# EAGLE design OpenMV-2L (EAGLE 7.5.0)
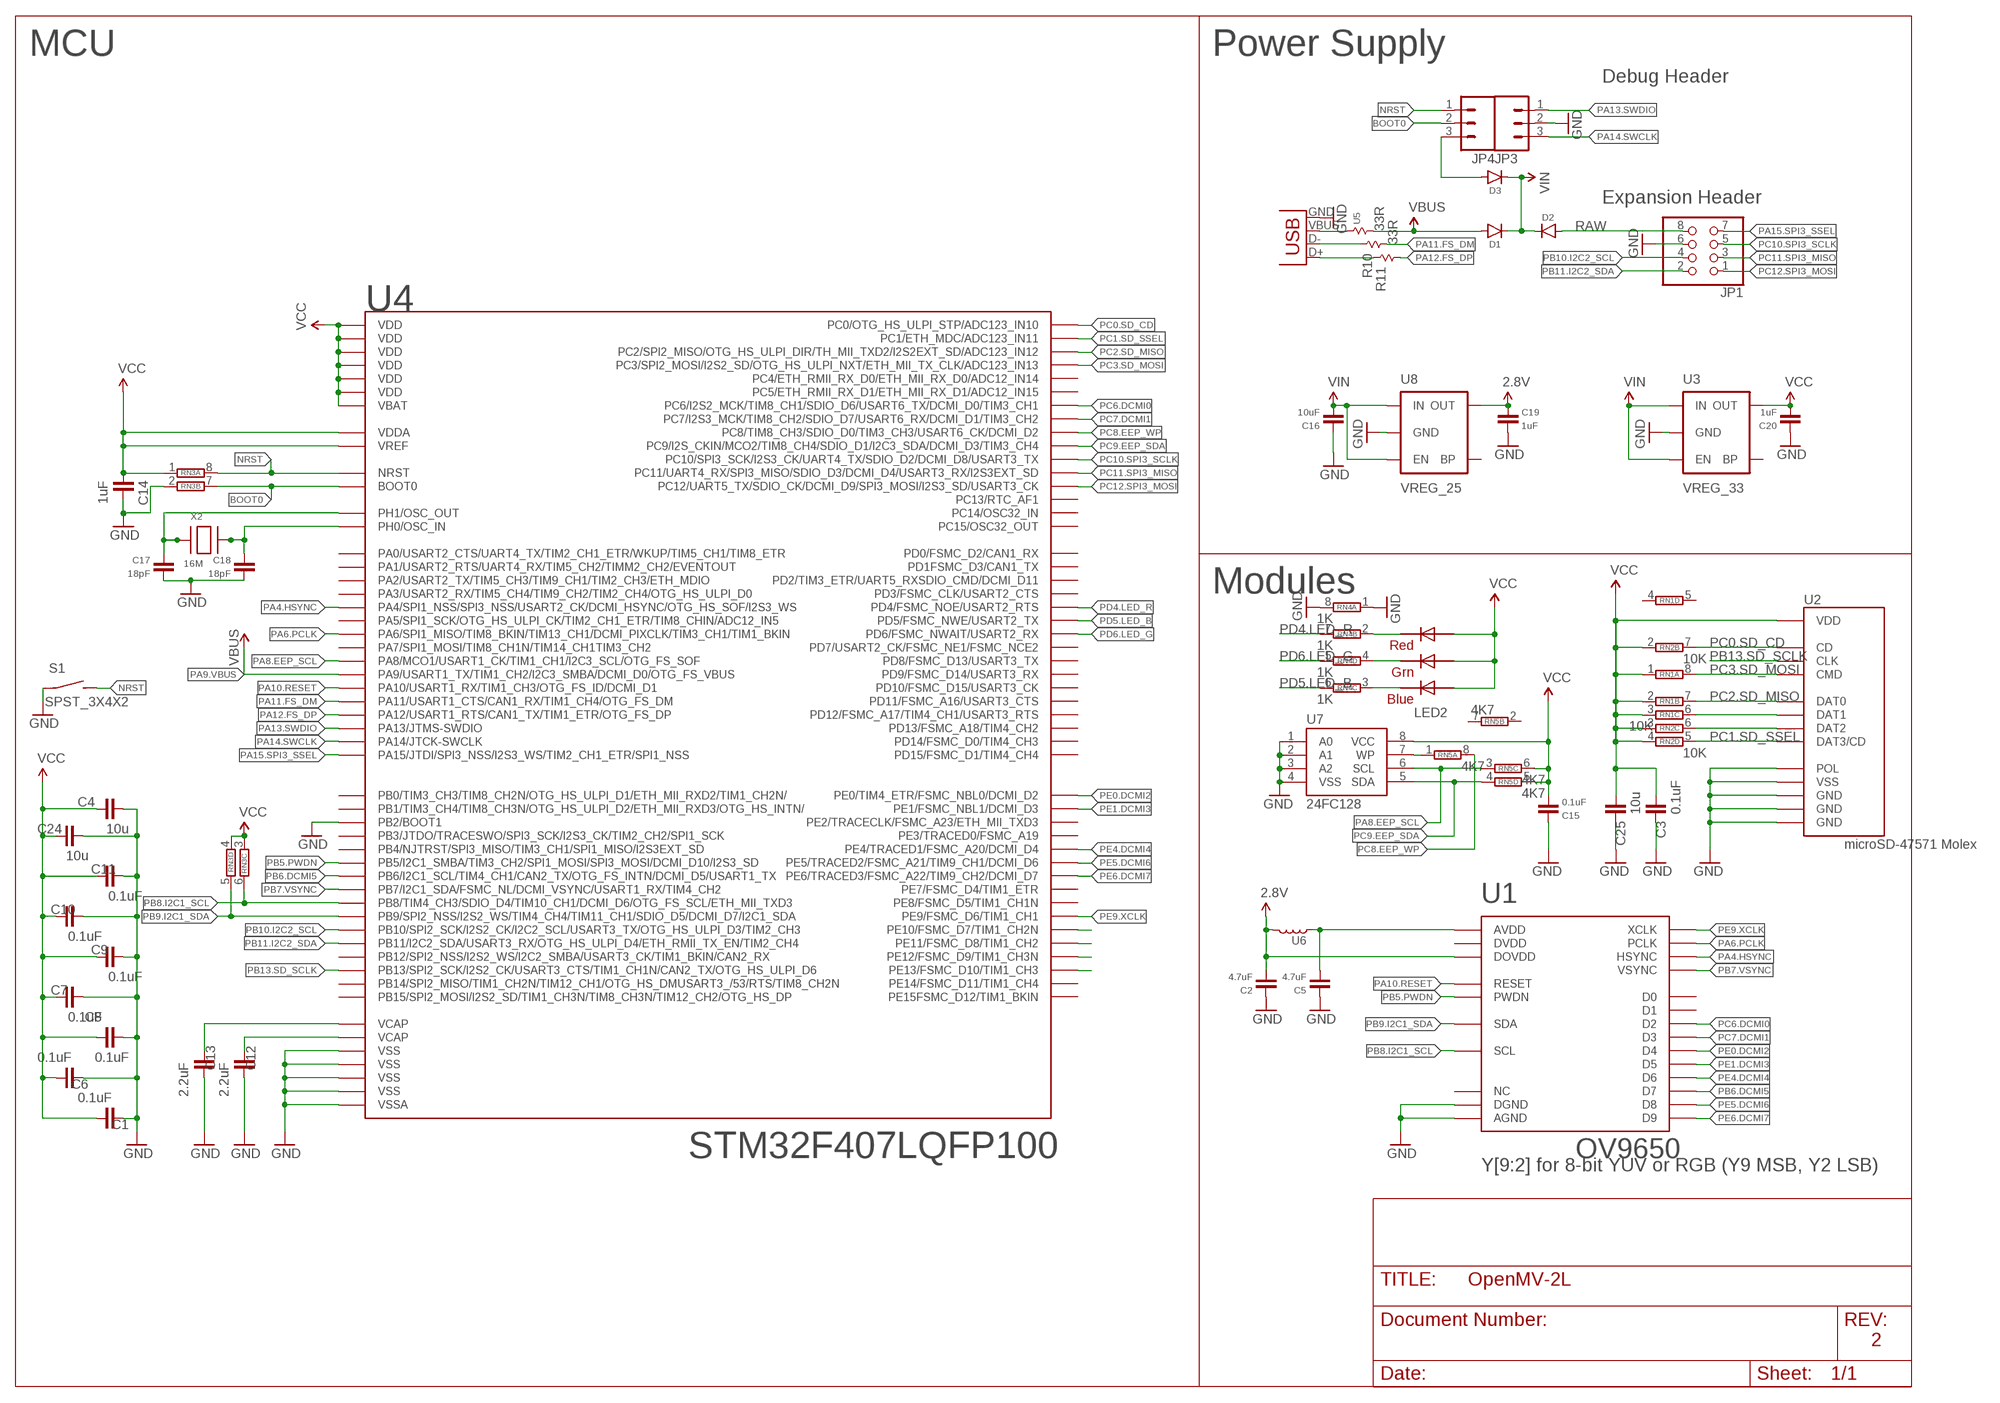
[diagram p0: schematic, sheet 1]

## Parts
C1  0.1uF  CAP-0402  [0402]
C2  4.7uF  CAP-0603  [0603]
C3  0.1uF  CAP-0402  [0402]
C4  10u  CAP-0805  [0805]
C5  4.7uF  CAP-0603  [0603]
C6  0.1uF  CAP-0402  [0402]
C7  0.1uF  CAP-0402  [0402]
C8  0.1uF  CAP-0402  [0402]
C9  0.1uF  CAP-0402  [0402]
C10  0.1uF  CAP-0402  [0402]
C11  0.1uF  CAP-0402  [0402]
C12  2.2uF  CAP-0402  [0402]
C13  2.2uF  CAP-0402  [0402]
C14  1uF  CAP-0402  [0402]
C15  0.1uF  CAP-0603  [0603]
C16  10uF  CAP-0805  [0805]
C17  18pF  CAP-0402  [0402]
C18  18pF  CAP-0402  [0402]
C19  1uF  CAP-0603  [0603]
C20  1uF  CAP-0603  [0603]
C24  10u  CAP-0805  [0805]
C25  10u  CAP-0805  [0805]
D1  DIODE-SOD-323  [SOD-323]
D2  DIODE-SOD-323  [SOD-323]
D3  DIODE-SOD-323  [SOD-323]
JP1  PINHD-2X4  [2X04]
JP3  M03PTH  [1X03]
JP4  M03PTH  [1X03]
LED2  RGBLED5050  [RGBLED5050]
R10  33R  RESISTOR-0402  [0402]
R11  33R  RESISTOR-0402  [0402]
RN1  4R-NCAT16  [CAT16]
RN2  10K  4R-NCAT16  [CAT16]
RN3  4R-NCAT16  [CAT16]
RN4  1K  4R-NCAT16  [CAT16]
RN5  4K7  4R-NCAT16  [CAT16]
S1  SPST_3X4X2  [3X4X2TACT]
U1  OV9650  [OV9650]
U2  microSD-47571 Molex  USD-47571  [USD-47571]
U3  VREG_33  V_REG_LDOSMD  [SOT23-5]
U4  STM32F407LQFP100  [LQFP100]
U5  RESISTOR-0402  [0402]
U6  INDUCTOR-0603  [0603]
U7  24FC128  [MSOP8]
U8  VREG_25  V_REG_LDOSMD  [SOT23-5]
X1  USB-MICROB  [USB-MICROB]
X2  16M  XTALNX5032  [NX5032]

## Nets
2.8V: C2.1 C19.2 U1.P$11(DOVDD) U6.2 U8.5(OUT)
BOOT0: JP4.2 RN3.7 U4.94(BOOT0)
GND: C1.1 C2.2 C3.2 C4.1 C5.2 C6.1 C7.2 C8.1 C9.2 C10.2 C11.2 C12.2 C13.2 C14.1 C15.2 C16.2 C17.1 C18.1 C19.1 C20.2 C24.1 C25.2 JP1.6 JP3.2 RN3.2 RN4.1 RN4.8 S1.P$1(P) U1.P$2(AGND) U1.P$15(DGND) U2.G$1(GND) U2.G$2(GND) U2.G$3(GND) U2.G$4(POL) U2.P$6(VSS) U3.2(GND) U4.10(VSS) U4.20(VSSA) U4.27(VSS) U4.37(PB2/BOOT1) U4.74(VSS) U4.99(VSS) U7.1(A0) U7.2(A1) U7.3(A2) U7.4(VSS) U8.2(GND) X1.GND
N$1: RN1.6 U2.P$8(DAT1)
N$2: RN2.6 U2.P$1(DAT2)
N$3: LED2.5(RED_C) RN4.2
N$4: LED2.6(GREEN_C) RN4.4
N$5: LED2.4(BLUE_C) RN4.3
N$6: C17.2 U4.13(PH1/OSC_OUT) X2.P$1
N$8: C18.2 U4.12(PH0/OSC_IN) X2.P$2
N$9: RN5.1 U7.7(WP)
N$10: C5.1 U1.P$4(AVDD) U6.1
N$11: D3.2(A) JP4.3
N$12: U4.41(PE10/FSMC_D7/TIM1_CH2N)
N$13: U4.42(PE11/FSMC_D8/TIM1_CH2)
N$14: U4.43(PE12/FSMC_D9/TIM1_CH3N)
N$15: U4.44(PE13/FSMC_D10/TIM1_CH3)
N$20: R10.1 X1.D-
N$21: R11.1 X1.D+
N$22: U5.1 X1.VBUS
NRST: JP4.1 RN3.8 S1.P$2(S) U4.14(NRST)
PA4.HSYNC: U1.P$9(HSYNC) U4.29(PA4/SPI1_NSS/SPI3_NSS/USART2_CK/DCMI_HSYNC/OTG_HS_SOF/I2S3_WS)
PA6.PCLK: U1.P$17(PCLK) U4.31(PA6/SPI1_MISO/TIM8_BKIN/TIM13_CH1/DCMI_PIXCLK/TIM3_CH1/TIM1_BKIN)
PA8.EEP_SCL: RN5.3 U4.67(PA8/MCO1/USART1_CK/TIM1_CH1/I2C3_SCL/OTG_FS_SOF) U7.6(SCL)
PA9.VBUS: D1.2(A) U4.68(PA9/USART1_TX/TIM1_CH2/I2C3_SMBA/DCMI_D0/OTG_FS_VBUS) U5.2 ; supply symbol labelled VBUS
PA10.RESET: U1.P$6(RESET) U4.69(PA10/USART1_RX/TIM1_CH3/OTG_FS_ID/DCMI_D1)
PA11.FS_DM: R10.2 U4.70(PA11/USART1_CTS/CAN1_RX/TIM1_CH4/OTG_FS_DM)
PA12.FS_DP: R11.2 U4.71(PA12/USART1_RTS/CAN1_TX/TIM1_ETR/OTG_FS_DP)
PA13.SWDIO: JP3.1 U4.72(PA13/JTMS-SWDIO)
PA14.SWCLK: JP3.3 U4.76(PA14/JTCK-SWCLK)
PA15.SPI3_SSEL: JP1.7 U4.77(PA15/JTDI/SPI3_NSS/I2S3_WS/TIM2_CH1_ETR/SPI1_NSS)
PB5.PWDN: U1.P$8(PWDN) U4.91(PB5/I2C1_SMBA/TIM3_CH2/SPI1_MOSI/SPI3_MOSI/DCMI_D10/I2S3_SD)
PB6.DCMI5: U1.P$16(D7) U4.92(PB6/I2C1_SCL/TIM4_CH1/CAN2_TX/OTG_FS_INTN/DCMI_D5/USART1_TX)
PB7.VSYNC: U1.P$7(VSYNC) U4.93(PB7/I2C1_SDA/FSMC_NL/DCMI_VSYNC/USART1_RX/TIM4_CH2)
PB8.I2C1_SCL: RN3.6 U1.P$5(SCL) U4.95(PB8/TIM4_CH3/SDIO_D4/TIM10_CH1/DCMI_D6/OTG_FS_SCL/ETH_MII_TXD3)
PB9.I2C1_SDA: RN3.5 U1.P$3(SDA) U4.96(PB9/SPI2_NSS/I2S2_WS/TIM4_CH4/TIM11_CH1/SDIO_D5/DCMI_D7/I2C1_SDA)
PB10.I2C2_SCL: JP1.4 U4.47(PB10/SPI2_SCK/I2S2_CK/I2C2_SCL/USART3_TX/OTG_HS_ULPI_D3/TIM2_CH3)
PB11.I2C2_SDA: JP1.2 U4.48(PB11/I2C2_SDA/USART3_RX/OTG_HS_ULPI_D4/ETH_RMII_TX_EN/TIM2_CH4)
PB13.SD_SCLK: U2.P$5(CLK) U4.52(PB13/SPI2_SCK/I2S2_CK/USART3_CTS/TIM1_CH1N/CAN2_TX/OTG_HS_ULPI_D6)
PC0.SD_CD: RN2.7 U2.G$5(CD) U4.15(PC0/OTG_HS_ULPI_STP/ADC123_IN10)
PC1.SD_SSEL: RN2.5 U2.P$2(DAT3/CD) U4.16(PC1/ETH_MDC/ADC123_IN11)
PC2.SD_MISO: RN1.7 U2.P$7(DAT0) U4.17(PC2/SPI2_MISO/OTG_HS_ULPI_DIR/TH_MII_TXD2/I2S2EXT_SD/ADC123_IN12)
PC3.SD_MOSI: RN1.8 U2.P$3(CMD) U4.18(PC3/SPI2_MOSI/I2S2_SD/OTG_HS_ULPI_NXT/ETH_MII_TX_CLK/ADC123_IN13)
PC6.DCMI0: U1.P$19(D2) U4.63(PC6/I2S2_MCK/TIM8_CH1/SDIO_D6/USART6_TX/DCMI_D0/TIM3_CH1)
PC7.DCMI1: U1.P$21(D3) U4.64(PC7/I2S3_MCK/TIM8_CH2/SDIO_D7/USART6_RX/DCMI_D1/TIM3_CH2)
PC8.EEP_WP: RN5.8 U4.65(PC8/TIM8_CH3/SDIO_D0/TIM3_CH3/USART6_CK/DCMI_D2)
PC9.EEP_SDA: RN5.4 U4.66(PC9/I2S_CKIN/MCO2/TIM8_CH4/SDIO_D1/I2C3_SDA/DCMI_D3/TIM3_CH4) U7.5(SDA)
PC10.SPI3_SCLK: JP1.5 U4.78(PC10/SPI3_SCK/I2S3_CK/UART4_TX/SDIO_D2/DCMI_D8/USART3_TX)
PC11.SPI3_MISO: JP1.3 U4.79(PC11/UART4_RX/SPI3_MISO/SDIO_D3/DCMI_D4/USART3_RX/I2S3EXT_SD)
PC12.SPI3_MOSI: JP1.1 U4.80(PC12/UART5_TX/SDIO_CK/DCMI_D9/SPI3_MOSI/I2S3_SD/USART3_CK)
PD4.LED_R: RN4.7 U4.85(PD4/FSMC_NOE/USART2_RTS)
PD5.LED_B: RN4.6 U4.86(PD5/FSMC_NWE/USART2_TX)
PD6.LED_G: RN4.5 U4.87(PD6/FSMC_NWAIT/USART2_RX)
PE0.DCMI2: U1.P$22(D4) U4.97(PE0/TIM4_ETR/FSMC_NBL0/DCMI_D2)
PE1.DCMI3: U1.P$20(D5) U4.98(PE1/FSMC_NBL1/DCMI_D3)
PE4.DCMI4: U1.P$18(D6) U4.3(PE4/TRACED1/FSMC_A20/DCMI_D4)
PE5.DCMI6: U1.P$14(D8) U4.4(PE5/TRACED2/FSMC_A21/TIM9_CH1/DCMI_D6)
PE6.DCMI7: U1.P$12(D9) U4.5(PE6/TRACED3/FSMC_A22/TIM9_CH2/DCMI_D7)
PE9.XCLK: U1.P$13(XCLK) U4.40(PE9/FSMC_D6/TIM1_CH1)
RAW: D2.2(A) JP1.8
VCAP1: C13.1 U4.49(VCAP)
VCAP2: C12.1 U4.73(VCAP)
VCC: C1.2 C3.1 C4.2 C6.2 C7.1 C8.2 C9.1 C10.1 C11.1 C14.2 C15.1 C20.1 C24.2 C25.1 LED2.1(GREEN_A) LED2.2(RED_A) LED2.3(BLUE_A) RN1.1 RN1.2 RN1.3 RN2.2 RN2.3 RN2.4 RN3.1 RN3.3 RN3.4 RN5.5 RN5.6 U2.P$4(VDD) U3.5(OUT) U4.6(VBAT) U4.11(VDD) U4.19(VDD) U4.21(VREF) U4.22(VDDA) U4.28(VDD) U4.50(VDD) U4.75(VDD) U4.100(VDD) U7.8(VCC)
VIN: C16.1 D1.1(C) D2.1(C) D3.1(C) U3.1(IN) U3.3(EN) U8.1(IN) U8.3(EN)
Unconnected: RN1.4 RN1.5 RN2.1 RN2.8 RN5.2 RN5.7 U1.P$1(NC) U1.P$10(DVDD) U1.P$23(D1) U1.P$24(D0) U3.4(BP) U4.1(PE2/TRACECLK/FSMC_A23/ETH_MII_TXD3) U4.2(PE3/TRACED0/FSMC_A19) U4.7(PC13/RTC_AF1) U4.8(PC14/OSC32_IN) U4.9(PC15/OSC32_OUT) U4.23(PA0/USART2_CTS/UART4_TX/TIM2_CH1_ETR/WKUP/TIM5_CH1/TIM8_ETR) U4.24(PA1/USART2_RTS/UART4_RX/TIM5_CH2/TIMM2_CH2/EVENTOUT) U4.25(PA2/USART2_TX/TIM5_CH3/TIM9_CH1/TIM2_CH3/ETH_MDIO) U4.26(PA3/USART2_RX/TIM5_CH4/TIM9_CH2/TIM2_CH4/OTG_HS_ULPI_D0) U4.30(PA5/SPI1_SCK/OTG_HS_ULPI_CK/TIM2_CH1_ETR/TIM8_CHIN/ADC12_IN5) U4.32(PA7/SPI1_MOSI/TIM8_CH1N/TIM14_CH1TIM3_CH2) U4.33(PC4/ETH_RMII_RX_D0/ETH_MII_RX_D0/ADC12_IN14) U4.34(PC5/ETH_RMII_RX_D1/ETH_MII_RX_D1/ADC12_IN15) U4.35(PB0/TIM3_CH3/TIM8_CH2N/OTG_HS_ULPI_D1/ETH_MII_RXD2/TIM1_CH2N/) U4.36(PB1/TIM3_CH4/TIM8_CH3N/OTG_HS_ULPI_D2/ETH_MII_RXD3/OTG_HS_INTN/) U4.38(PE7/FSMC_D4/TIM1_ETR) U4.39(PE8/FSMC_D5/TIM1_CH1N) U4.45(PE14/FSMC_D11/TIM1_CH4) U4.46(PE15FSMC_D12/TIM1_BKIN) U4.51(PB12/SPI2_NSS/I2S2_WS/I2C2_SMBA/USART3_CK/TIM1_BKIN/CAN2_RX) U4.53(PB14/SPI2_MISO/TIM1_CH2N/TIM12_CH1/OTG_HS_DMUSART3_/53/RTS/TIM8_CH2N) U4.54(PB15/SPI2_MOSI/I2S2_SD/TIM1_CH3N/TIM8_CH3N/TIM12_CH2/OTG_HS_DP) U4.55(PD8/FSMC_D13/USART3_TX) U4.56(PD9/FSMC_D14/USART3_RX) U4.57(PD10/FSMC_D15/USART3_CK) U4.58(PD11/FSMC_A16/USART3_CTS) U4.59(PD12/FSMC_A17/TIM4_CH1/USART3_RTS) U4.60(PD13/FSMC_A18/TIM4_CH2) U4.61(PD14/FSMC_D0/TIM4_CH3) U4.62(PD15/FSMC_D1/TIM4_CH4) U4.81(PD0/FSMC_D2/CAN1_RX) U4.82(PD1FSMC_D3/CAN1_TX) U4.83(PD2/TIM3_ETR/UART5_RXSDIO_CMD/DCMI_D11) U4.84(PD3/FSMC_CLK/USART2_CTS) U4.88(PD7/USART2_CK/FSMC_NE1/FSMC_NCE2) U4.89(PB3/JTDO/TRACESWO/SPI3_SCK/I2S3_CK/TIM2_CH2/SPI1_SCK) U4.90(PB4/NJTRST/SPI3_MISO/TIM3_CH1/SPI1_MISO/I2S3EXT_SD) U8.4(BP)

## Notes on the sheet
- MCU | Power Supply
- Debug Header
- Expansion Header
- Modules
- Y[9:2] for 8-bit YUV or RGB (Y9 MSB, Y2 LSB)
- 2

## Library data of the parts
C1-C20 C24 C25 = X893:CAP: Capacitor
D1-D3 = X893:DIODE
JP1 = pinhead:PINHD-2X4: PIN HEADER
JP3 JP4 = SparkFun:M03: Header 3 Standard 3-pin 0.1" header. Use with straight break away headers (SKU : PRT-00116), right angle break away headers (PRT-00553), swiss pins (PRT-00743), machine pins (PRT-00117), and female headers (PRT-00115). Molex polarized connector foot print use with SKU : PRT-08232 with associated crimp pins and housings.
LED2 = adafruit:RGBLED: For 5050 RGB LEDs, the order of the LEDs may vary from one manufacturer to another!
R10 R11 U5 = X893:RESISTOR
RN1-RN5 = resistor-dil:4R-N: Array Chip Resistor Source: RS Component / Phycomp; OC_FARNELL: unknown; OC_NEWARK: unknown
S1 = bt_electromech:SPST: SPST SWITCH
U1 = iofault:OV9650
U2 = mux:USD-47571
U3 U8 = sfe:V_REG_LDO: Voltage Regulator LDO Standard 150mA LDO voltage regulator in SOT-23 layout. Micrel part MIC5205. BP (by-pass) pin is used to lower output noise with 470pF cap.
U4 = mux:STM32F407
U6 = X893:INDUCTOR: http://www.murata.com/products/catalog/pdf/o05e.pdf
U7 = mux:24FC128
X1 = sfe:USB: USB Connectors USB-B-PTH is fully proven SKU : PRT-00139 USB-miniB is fully proven SKU : PRT-00587 USB-A-PCB is untested. USB-A-H is throughly reviewed, but untested. Spark Fun Electronics SKU : PRT-00437 USB-B-SMT is throughly reviewed, but untested. Needs silkscreen touching up. USB-A-S has not been used/tested USB-MB-H has not been used/tested
X2 = adafruit:XTAL: Low cost SMT crystals, no capacitors included http://www.ladyada.net/library/eagle

## Net classes
0 default: width 0.152 mm

## Board
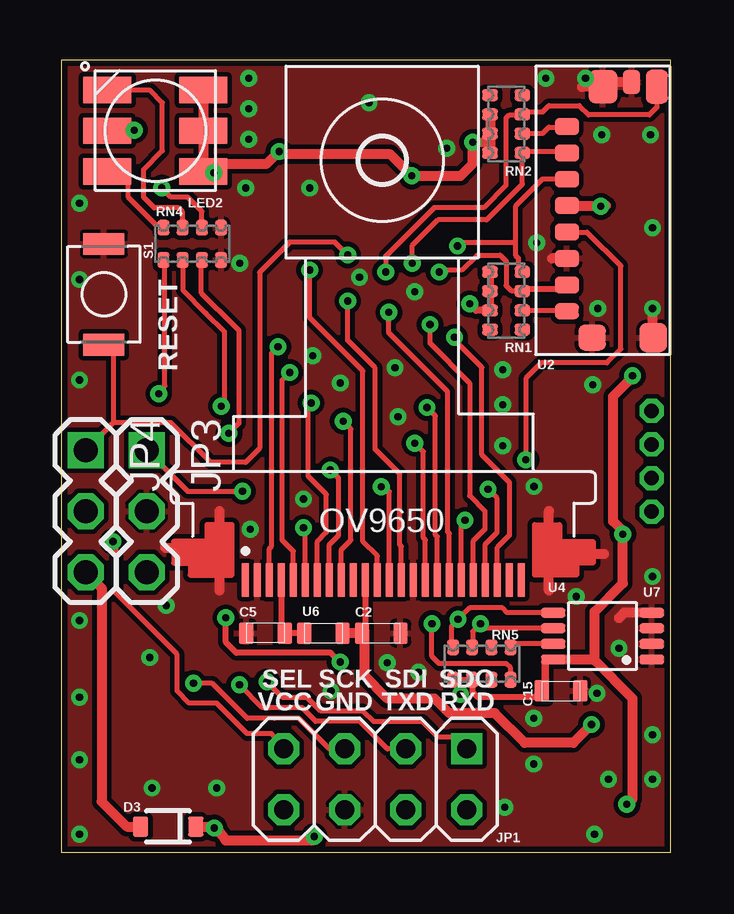
[diagram p1: board, top side]
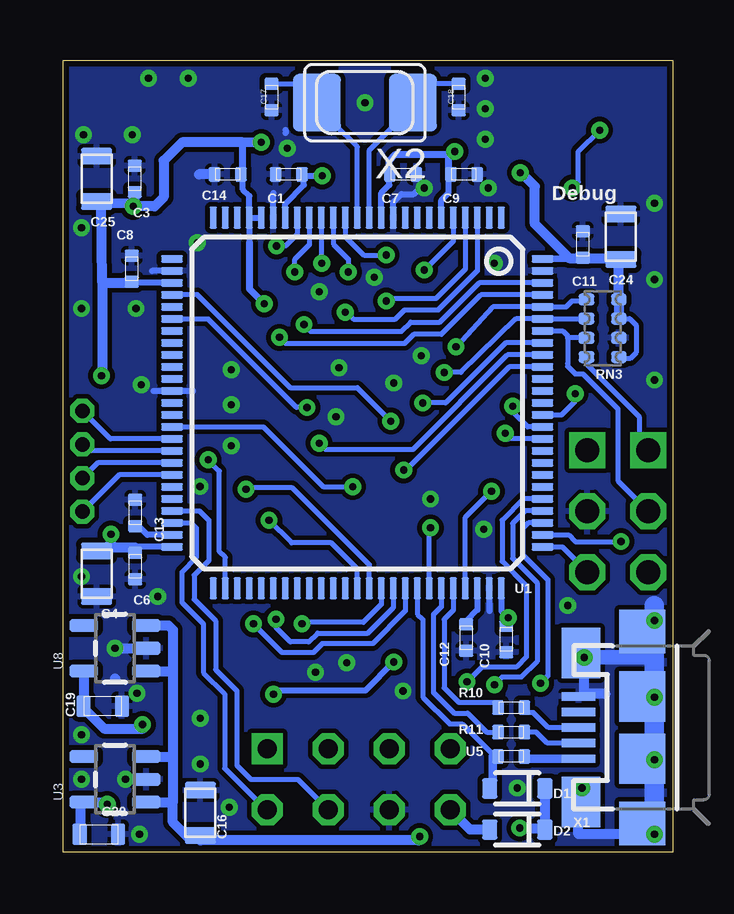
[diagram p2: board, bottom side, seen from below]

Size 25.4 x 33.02 mm. Coordinates in mm from the lower left corner, seen from the top.
Outline: 0,0 25.4,0 25.4,33.02 0,33.02 0,0
Copper layers (1+16): Top 0.018mm / dielectric 0.8mm / Bottom 0.018mm
Design rules "Rezonit-020-015": minimum track width 0.15mm, minimum drill 0.3mm, track to track 0.2mm, track to pad 0.2mm, pad to pad 0.2mm, via to via 0.2mm, smd to smd 0mil, copper to edge 0.25mm, drill to drill 0.3mm, minimum pad ring 0.2mm, minimum via ring 0.2mm, stop-mask expansion 4mil, vias tented up to drill 0.4mm, thermal gap 0.15mm

### Footprints (pad centres in the part's own frame; a part is rotated, then mirrored left to right if it is on the bottom)
0402 = smd 0.5 x 0.6: 1 -0.55,0; 2 0.55,0
0603 = smd 0.6 x 0.9: 1 -0.8,0; 2 0.8,0
0805 = smd 0.7 x 1.3: 1 -0.95,0; 2 0.95,0
SOD-323 = smd 0.63 x 0.83: 1 -1.15,0; 2 1.15,0
2X04 = drill 0.8 pad 1.3 square: 1 -3.81,-1.27 | drill 0.8 pad 1.3 octagon: 2 -3.81,1.27; 3 -1.27,-1.27; 4 -1.27,1.27; 5 1.27,-1.27; 6 1.27,1.27; 7 3.81,-1.27; 8 3.81,1.27
1X03 = drill 1 pad 1.5 square: 1 0,0 | drill 1 pad 1.5 octagon: 2 2.54,0; 3 5.08,0
RGBLED5050 = smd 2 x 1.1: 1 -2,1.7; 2 -2,0; 3 -2,-1.7; 4 2,-1.7; 5 2,0; 6 2,1.7
CAT16 = smd 0.5 x 0.65: 1 -1.2,-0.675; 2 -0.4,-0.675; 3 0.4,-0.675; 4 1.2,-0.675; 5 1.2,0.675; 6 0.4,0.675; 7 -0.4,0.675; 8 -1.2,0.675
3X4X2TACT = smd 0.9 x 1.7: P$1 -2.1,0; P$2 2.1,0
OV9650 = smd 0.3 x 1.4: P$1 -5.6,-11.5; P$2 -5.1,-11.5; P$3 -4.6,-11.5; P$4 -4.1,-11.5; P$5 -3.6,-11.5; P$6 -3.1,-11.5; P$7 -2.6,-11.5; P$8 -2.1,-11.5; P$9 -1.6,-11.5; P$10 -1.1,-11.5; P$11 -0.6,-11.5; P$12 -0.1,-11.5; P$13 0.4,-11.5; P$14 0.9,-11.5; P$15 1.4,-11.5; P$16 1.9,-11.5; P$17 2.4,-11.5; P$18 2.9,-11.5; P$19 3.4,-11.5; P$20 3.9,-11.5; P$21 4.4,-11.5; P$22 4.9,-11.5; P$23 5.4,-11.5; P$24 5.9,-11.5
USD-47571 = smd 1.1 x 1.15: G$1 -4.9,0.55 | smd 1.2 x 1.15: G$2 -4.9,-2 | smd 1.4 x 1.2: G$3 5.55,0.1 | smd 1 x 0.7: G$4 5.75,-1.1 | smd 1.4 x 0.9: G$5 5.55,-2.15 | smd 0.7 x 1: P$1 3.9,1.6; P$2 2.8,1.6; P$3 1.7,1.6; P$4 0.6,1.6; P$5 -0.5,1.6; P$6 -1.6,1.6; P$7 -2.7,1.6 | smd 0.65 x 1: P$8 -3.8,1.6
SOT23-5 = smd 0.55 x 1.2: 1 -0.95,-1.3; 2 0,-1.3; 3 0.95,-1.3; 4 0.95,1.3; 5 -0.95,1.3
LQFP100 = smd 0.9 x 0.3: 1 -7.72,6; 2 -7.72,5.5; 3 -7.72,5; 4 -7.72,4.5; 5 -7.72,4; 6 -7.72,3.5; 7 -7.72,3; 8 -7.72,2.5; 9 -7.72,2; 10 -7.72,1.5; 11 -7.72,1; 12 -7.72,0.5; 13 -7.72,0; 14 -7.72,-0.5; 15 -7.72,-1; 16 -7.72,-1.5; 17 -7.72,-2; 18 -7.72,-2.5; 19 -7.72,-3; 20 -7.72,-3.5; 21 -7.72,-4; 22 -7.72,-4.5; 23 -7.72,-5; 24 -7.72,-5.5; 25 -7.72,-6; 51 7.72,-6; 52 7.72,-5.5; 53 7.72,-5; 54 7.72,-4.5; 55 7.72,-4; 56 7.72,-3.5; 57 7.72,-3; 58 7.72,-2.5; 59 7.72,-2; 60 7.72,-1.5; 61 7.72,-1; 62 7.72,-0.5; 63 7.72,0; 64 7.72,0.5; 65 7.72,1; 66 7.72,1.5; 67 7.72,2; 68 7.72,2.5; 69 7.72,3; 70 7.72,3.5; 71 7.72,4; 72 7.72,4.5; 73 7.72,5; 74 7.72,5.5; 75 7.72,6 | smd 0.3 x 0.9: 26 -6,-7.72; 27 -5.5,-7.72; 28 -5,-7.72; 29 -4.5,-7.72; 30 -4,-7.72; 31 -3.5,-7.72; 32 -3,-7.72; 33 -2.5,-7.72; 34 -2,-7.72; 35 -1.5,-7.72; 36 -1,-7.72; 37 -0.5,-7.72; 38 0,-7.72; 39 0.5,-7.72; 40 1,-7.72; 41 1.5,-7.72; 42 2,-7.72; 43 2.5,-7.72; 44 3,-7.72; 45 3.5,-7.72; 46 4,-7.72; 47 4.5,-7.72; 48 5,-7.72; 49 5.5,-7.72; 50 6,-7.72; 76 6,7.72; 77 5.5,7.72; 78 5,7.72; 79 4.5,7.72; 80 4,7.72; 81 3.5,7.72; 82 3,7.72; 83 2.5,7.72; 84 2,7.72; 85 1.5,7.72; 86 1,7.72; 87 0.5,7.72; 88 0,7.72; 89 -0.5,7.72; 90 -1,7.72; 91 -1.5,7.72; 92 -2,7.72; 93 -2.5,7.72; 94 -3,7.72; 95 -3.5,7.72; 96 -4,7.72; 97 -4.5,7.72; 98 -5,7.72; 99 -5.5,7.72; 100 -6,7.72
MSOP8 = smd 0.4 x 1: 1 -0.975,-2.05; 2 -0.325,-2.05; 3 0.325,-2.05; 4 0.975,-2.05; 5 0.975,2.05; 6 0.325,2.05; 7 -0.325,2.05; 8 -0.975,2.05
USB-MICROB = smd 0.35 x 1.4: D+ 0,2.65; D- -0.65,2.65; GND 1.3,2.65; ID 0.65,2.65; VBUS -1.3,2.65 | smd 1.8 x 1.9: MT1 -4,0; MT2 4,0 | smd 2.1 x 1.6: MT3 3.1,2.55; MT4 -3.1,2.55 | smd 2.1 x 1.9: MT5 -1.3,0; MT6 1.3,0
NX5032 = smd 2 x 2.4: P$1 2,0; P$2 -2,0

### Placement (x,y rotation side)
C1  16,28.26 0 bottom
C2  13.34,9.14 0 top
C3  22.42,28.07 90 bottom
C4  24,11.61 90 bottom
C5  8.51,9.14 180 top
C6  22.4,11.93 90 bottom
C7  11.24,28.26 0 bottom
C8  22.54,24.32 270 bottom
C9  8.7,28.26 0 bottom
C10  6.94,8.89 270 bottom
C11  3.75,25.34 90 bottom
C12  8.61,8.95 270 bottom
C13  22.4,14.15 90 bottom
C14  18.54,28.26 0 bottom
C15  20.83,6.73 0 top
C16  19.68,1.65 90 bottom
C17  16.72,31.47 90 bottom
C18  8.92,31.47 90 bottom
C19  23.75,6.1 180 bottom
C20  23.91,0.76 0 bottom
C24  2.16,25.65 270 bottom
C25  24,28.07 90 bottom
D1  6.48,2.67 180 bottom
D2  6.48,0.95 180 bottom
D3  4.45,1.08 180 top
JP1  13.08,3.05 180 top
JP3  3.56,16.76 270 top
JP4  1.02,16.76 270 top
LED2  3.93,30.07 180 top
R10  6.73,5.02 180 bottom
R11  6.73,6.03 180 bottom
RN1  18.54,22.99 270 top
RN2  18.54,30.35 270 top
RN3  2.92,21.84 90 bottom
RN4  5.46,25.36 180 top
RN5  17.53,7.87 180 top
S1  1.78,23.26 270 top
U1  13.27,22.86 0 top
U2  22.67,26.35 90 top
U3  23.24,3.05 90 bottom
U4  13.14,18.73 270 bottom
U5  6.73,4 180 bottom
U6  10.92,9.14 0 top
U7  22.55,9.02 90 top
U8  23.24,8.51 90 bottom
X1  1.27,5.21 90 bottom
X2  12.83,31.24 180 bottom

### Tracks (layer width: path | path; a pad name or v marks a point on that pad's centre or on a via)
2.8V  (via drill 0.3)
  Top 0.254: U1.P$11 12.67,9.24 12.64,9.14
  Top 0.406: U6.2 C2.1 12.64,9.14 12.62,9.29 12.62,7.38 13.59,6.41 15.56,6.41 16.17,5.81 18.07,5.81 19.3,4.57 21.34,4.57 v22.1,5.33
  Bottom 0.406: U8.5 24.54,6.24 C19.2 24.55,6.02 23.69,5.16 22.08,5.16 v22.1,5.33
BOOT0
  Bottom 0.2: U4.94 4.59,21.73 4.38,21.53 4.38,21.44 | 4.38,21.44 4.38,20.38 | RN3.7 4.38,21.44
  Bottom 0.203: 4.38,20.38 4.38,20.26 4.06,19.94 3.75,19.94 2.29,18.48 2.29,15.49 JP4.2
GND  (via drill 0.3)
  Top 0.406: U2.P$6 20.46,24.75 | U2.G$4 22.77,32.1 U2.G$3 21.69,31.9 | 24.64,21.42 v24.64,22.66 | U7.4 23.45,9.99 23.24,9.78 | 20.32,10.92 20.32,12.45 | 20.32,12.45 20.32,14.22 | 20.32,12.45 22.61,12.45 | 6.6,10.92 6.6,12.7 | 6.6,12.7 6.6,14.22 | 4.32,12.7 6.6,12.7
  Bottom 0.25: U4.20 16.64,27.49 | U4.27 21.69,24.23
  Bottom 0.254: U4.37 19.99,19.23 | U4.74 7.64,10.06 | U4.10 11.64,27.09 11.3,27.43 10.79,27.43 10.6,27.62 | 10.6,28.24 C7.2 | 16.13,30.1 16.13,29.97 | 21.63,19.23 21.01,19.23
  Bottom 0.305: 0.77,23.86 v0.76,23.88
  Bottom 0.406: 19.18,28.26 C14.1 19.75,28.26 | 23.23,7.22 23.24,7.24 | v0.76,0.76 3.94,0.76 3.94,2.67 | 2.79,6.6 3.68,6.6 v3.68,8.13 | 22.86,3.05 21.84,3.05 | v23.24,8.51 21.72,8.51
  Bottom 0.61: v3.68,8.13 1.02,8.13
  Bottom 0.813: v0.76,0.76 0.76,10.29
  other vias: 24.64,26.03 10.35,27.69 7.81,29.72 18.4,18.65 22.36,22.66 4.38,10.29 19.81,25.4 21.84,32.26 24.55,29.91 13.59,7.91 21.46,10.67 24.64,3.05 22.22,0.76 22.32,6.64 19.68,3.68 16.07,29.34 22.52,29.91 10.48,20.7 10.1,14.73 11.62,19.56 14.03,18.16 13.91,20.19 0.76,19.68 0.76,27.05 7.44,24.55 7.87,13.46 14.73,23.37 7.68,27.69 7.81,32.26 12.83,31.24 11.24,6.73 19.68,5.59 20.19,32.26 7.81,30.99 18.4,20.12 22.15,19.49 18.48,1.88 22.8,3.05 24.64,4.9 6.49,2.68 0.76,9.66 0.76,6.46 0.76,3.86 3.79,2.68 18.4,16.95 19.7,15.25 14.89,7.51 12.43,23.97 24.64,11.5
  pour Bottom (isolate 0.2): 0,33.02 25.4,33.02 25.4,0 0,0
  pour Top (isolate 0.2): 0,33.02 25.4,33.02 25.4,0 0,0
N$1
  Top 0.203: U2.P$8 21.01,22.55 20.97,22.59 RN1.6
N$2
  Top 0.203: RN2.6 19.29,29.95 19.3,29.97 20.07,29.97 20.32,30.23 21.04,30.23 U2.P$1
N$3  (via drill 0.3)
  Top 0.203: LED2.5 3.07,30.07 v3.05,30.1 | RN4.2 5.86,26.71 5.27,27.3 4.57,27.3 v4.19,27.69
  Bottom 0.203: v4.19,27.69 3.94,27.94 3.94,29.21 v3.05,30.1
N$4
  Top 0.203: RN4.4 4.26,26.09 4.19,26.16 3.94,26.16 2.79,27.3 2.79,28.32 2.67,28.45 1.98,28.45 LED2.6
N$5
  Top 0.203: RN4.3 5.06,26.69 4.89,26.86 3.87,26.86 3.43,27.3 3.43,28.45 4.22,29.24 4.22,31.24 3.71,31.75 2.08,31.75 LED2.4
N$6
  Bottom 0.2: C17.2 15.61,32.02 X2.P$1
  Bottom 0.203: U4.13 13.14,29.4 14.1,30.35 14.1,30.51 X2.P$1
N$8
  Bottom 0.2: C18.2 10.05,32.02 X2.P$2
  Bottom 0.203: U4.12 12.64,29.27 10.92,30.99 10.92,31.15 X2.P$2
N$9
  Top 0.203: U7.7 20.25,8.64 20.13,8.64 20.07,8.7 18.88,8.7 RN5.1
N$10
  Top 0.25: U6.1 C5.1 9.27,9.16 9.27,9.27 9.17,9.37 U1.P$4
N$11
  Top 0.406: D3.2 2.73,1.08 1.69,2.12 1.69,11.01 JP4.3
N$12  (via drill 0.6)
  Bottom 0.203: U4.41 23.43,17.23 v24.6,18.4
N$13  (via drill 0.6)
  Bottom 0.203: U4.42 24.33,16.73 v24.6,17
N$14  (via drill 0.6)
  Bottom 0.203: U4.43 23.97,16.23 v24.6,15.6
N$15  (via drill 0.6)
  Bottom 0.203: U4.44 23.07,15.73 v24.6,14.2
N$20
  Bottom 0.203: X1.D- 5.23,4.56 5.69,5.02 R10.1
N$21
  Bottom 0.203: X1.D+ 5.18,5.21 5.81,5.83 5.98,5.83 R11.1
N$22
  Bottom 0.356: X1.VBUS 6.15,3.91 U5.1
NRST  (via drill 0.3)
  Top 0.203: S1.P$2 1.91,21.16 2.16,20.97 2.16,17.91 | 2.16,17.91 JP4.1 | 2.16,17.91 4.57,17.91 6.22,16.26 7.68,16.26 8.26,16.84 8.26,24.17 9.52,25.43 11.4,25.43 v11.94,24.89
  Bottom 0.203: U4.14 13.64,25.66 12.87,24.89 v11.94,24.89 | RN3.8 3.56,20.6 3.56,20.32 1.4,18.16 1.4,17.14 JP4.1
PA4.HSYNC  (via drill 0.3)
  Top 0.203: v11.75,17.97 12.06,17.65 12.06,13.02 11.67,12.62 U1.P$9
  Bottom 0.2: 19.42,22.85 19.81,23.24 U4.29
  Bottom 0.203: 19.42,22.85 15.94,19.37 13.14,19.37 v11.75,17.97
PA6.PCLK  (via drill 0.3)
  Top 0.203: U1.P$17 15.67,13.16 15.59,13.23 15.59,18.19 v15.24,18.54
  Bottom 0.203: U4.31 19.38,22.23 15.68,18.54 v15.24,18.54
PA8.EEP_SCL  (via drill 0.3)
  Top 0.203: U7.6 17.66,9.34 v17.47,9.53 17.14,9.2 17.14,8.57 RN5.3
  Bottom 0.203: U4.67 11.14,10.06 12.51,8.7 14.61,8.7 14.98,8.33 16.27,8.33 v17.47,9.53
PA9.VBUS
  Bottom 0.203: U4.68 10.64,9.93 10.41,9.72 10.41,6.48 9.3,5.36 8.77,5.36 7.46,4.05 7.36,4.07 7.29,4
  Bottom 0.356: U5.2 7.29,4 7.49,4 7.49,2.8 D1.2
PA10.RESET  (via drill 0.3)
  Top 0.203: U1.P$6 10.17,13.45 v10.1,13.53
  Bottom 0.203: U4.69 10.14,13.48 v10.1,13.53
PA11.FS_DM
  Bottom 0.203: U4.70 9.64,10.23 9.97,9.91 9.97,6.67 9.11,5.81 8.55,5.81 7.76,5.02 R10.2
PA12.FS_DP
  Bottom 0.203: U4.71 9.14,10.1 9.53,9.72 9.53,6.86 8.92,6.25 7.39,6.25 7.36,6.22 7.34,6.22 R11.2
PA13.SWDIO  (via drill 0.3)
  Top 0.203: JP3.1 5.27,15.05 v7.56,15.05
  Bottom 0.203: U4.72 8.64,13.96 v7.56,15.05
PA14.SWCLK
  Bottom 0.203: U4.76 4.6,12.73 JP3.3
PA15.SPI3_SSEL  (via drill 0.3)
  Top 0.203: JP1.7 8.76,4.95 7.75,4.95 6.48,6.22 5.33,6.22 4.83,6.73 4.83,8.26 2.29,10.79 2.29,12.83 v2.16,12.95
  Bottom 0.203: U4.77 4.34,13.23 4.06,12.95 v2.16,12.95
PB5.PWDN  (via drill 0.3)
  Top 0.203: U1.P$8 11.17,12.82 11.56,13.21 11.56,15.59 v11.21,15.94
  Bottom 0.203: v11.21,15.94 11.11,15.94 6.82,20.23 U4.91
PB6.DCMI5  (via drill 0.3)
  Top 0.203: U1.P$16 15.17,13.02 15.09,13.11 15.09,16.7 v14.73,17.05
  Bottom 0.203: U4.92 6.89,20.73 10.82,16.8 14.48,16.8 v14.73,17.05
PB7.VSYNC  (via drill 0.3)
  Top 0.203: v10.41,18.73 10.29,18.61 10.29,15.68 11.05,14.92 11.05,13.34 10.67,12.96 U1.P$7
  Bottom 0.2: 6.96,21.23 9.46,18.73 v10.41,18.73
  Bottom 0.203: U4.93 6.96,21.23
PB8.I2C1_SCL  (via drill 0.3)
  Top 0.2: 9.21,13.02 9.21,19.68 v9.53,20
  Top 0.203: U1.P$5 9.67,12.55 9.21,13.02
  Bottom 0.203: v9.53,20 8.83,20 6.53,22.23 U4.95 3.82,22.23 3.83,22.24 RN3.6
PB9.I2C1_SDA  (via drill 0.3)
  Top 0.203: U1.P$3 8.67,12.66 8.76,12.76 8.76,20.8 v9.03,21.07
  Bottom 0.203: v9.03,21.07 7.49,22.73 U4.96 4.45,22.73 4.19,22.99 3.78,22.99 RN3.5
PB10.I2C2_SCL
  Bottom 0.203: U4.47 19.72,14.23 19.33,13.84 19.33,12.16 19.94,11.56 19.94,10.54 19.05,9.65 19.05,7.62 18.16,6.73 18.16,3.63 17.58,3.05 15.62,3.05 JP1.4
PB11.I2C2_SDA
  Bottom 0.203: U4.48 20.08,13.73 19.84,13.49 19.84,12.29 20.45,11.68 20.45,10.41 19.56,9.53 19.56,7.49 18.67,6.6 18.67,3.5 16.95,1.78 JP1.2
PB13.SD_SCLK  (via drill 0.3)
  Top 0.203: U2.P$5 21.9,25.85 23.31,24.44 23.31,20.97 22.74,20.4 20,20.4 19.36,19.76 v19.36,16.36
  Bottom 0.203: U4.52 18.64,12.29 18.89,12.54 18.89,15.89 v19.36,16.36
PC0.SD_CD  (via drill 0.3)
  Top 0.203: U2.G$5 24.82,31.04 24.51,30.73 21.97,30.73 21.59,31.11 20.32,31.11 20.07,30.86 19.43,30.86 19.32,30.75 RN2.7 19.2,30.73 18.67,30.73 18.54,30.61 18.54,27.81 17.6,26.87 15.54,26.87 13.52,24.85 v13.52,24.18
  Bottom 0.203: U4.15 14.14,25.35 13.52,24.72 v13.52,24.18
PC1.SD_SSEL  (via drill 0.3)
  Top 0.203: v14.63,24.55 14.63,25.3 15.69,26.36 17.73,26.36 19.22,27.85 RN2.5 19.25,29.15 19.3,29.21 21.01,29.21 U2.P$2
  Bottom 0.203: U4.16 14.64,24.82 v14.63,24.55
PC2.SD_MISO  (via drill 0.3)
  Top 0.203: v15.75,24.18 15.78,24.28 16.72,24.28 17.33,24.89 18.29,24.89 18.54,24.64 18.54,23.62 18.78,23.39 RN1.7
  Top 0.254: U2.P$7 20.83,23.62 20.73,23.46 19.23,23.46 RN1.7
  Bottom 0.203: U4.17 15.14,25.33 15.75,24.73 v15.75,24.18
PC3.SD_MOSI  (via drill 0.3)
  Top 0.2: 18.92,26.92 18.92,25.4 18.92,24.89 19.05,24.77 19.05,24.23 RN1.8
  Top 0.203: 18.92,25.4 16.64,25.4 v16.51,25.27 | U2.P$3 20.05,28.05 18.92,26.92
  Bottom 0.203: U4.18 15.64,25.76 16.13,25.27 v16.51,25.27
PC6.DCMI0  (via drill 0.3)
  Top 0.203: U1.P$19 16.67,13.69 v16.83,13.84
  Bottom 0.203: U4.63 13.14,11.82 14.23,12.9 15.88,12.9 v16.83,13.84
PC7.DCMI1  (via drill 0.3)
  Top 0.2: U1.P$21 17.67,12.85 18.16,13.34 18.16,14.75 17.88,15.03 v17.78,15.14
  Bottom 0.2: 17.73,15.2 15.85,15.2 12.64,11.99 12.64,11.95
  Bottom 0.203: U4.64 12.64,11.95 | 17.73,15.2 v17.78,15.14
PC8.EEP_WP  (via drill 0.3)
  Top 0.203: RN5.8 18.73,7.69 18.54,7.87 15.75,7.87 15.44,8.18 15.44,9.44 v15.45,9.53
  Bottom 0.203: U4.65 12.14,10.34 12.89,9.59 15.3,9.59 v15.45,9.53
PC9.EEP_SDA  (via drill 0.3)
  Top 0.203: RN5.4 16.26,8.62 16.26,9.43 v16.53,9.72 17.03,10.19 18.39,10.19 18.58,9.99 U7.5
  Bottom 0.203: U4.66 11.64,10.2 12.7,9.14 14.8,9.14 15.17,8.77 15.93,8.77 16.53,9.37 v16.53,9.72
PC10.SPI3_SCLK  (via drill 0.3)
  Top 0.2: JP1.5 11.18,4.32 9.91,5.59 8.89,5.59
  Top 0.203: 8.89,5.59 7.75,5.59 6.29,7.05 v5.51,7.05
  Bottom 0.2: 6.22,12.38 6.22,13.53 6.02,13.73 U4.78
  Bottom 0.203: v5.51,7.05 5.21,7.36 5.21,11.37 6.22,12.38
PC11.SPI3_MISO  (via drill 0.3)
  Top 0.2: JP1.3 13.59,4.32 12.45,5.46 10.6,5.46 10.03,6.03 8.38,6.03
  Top 0.203: 8.38,6.03 v7.43,6.99
  Bottom 0.2: U4.79 6.15,14.23 6.67,13.72 6.67,12.26
  Bottom 0.203: v7.43,6.99 7.11,7.3 6.3,7.3 5.65,7.96 5.65,11.24 6.67,12.26
PC12.SPI3_MOSI  (via drill 0.3)
  Top 0.2: 9.21,6.48 10.22,6.48 10.79,5.91 12.57,5.91 13.02,5.46 15.05,5.46
  Top 0.203: 9.21,6.48 v8.57,7.11 | 15.05,5.46 15.68,4.83 16.51,4.83 JP1.1
  Bottom 0.2: U4.80 6.22,14.73 7.11,13.84 7.11,12.13 6.6,11.62
  Bottom 0.203: v8.57,7.11 7.94,7.75 6.5,7.75 6.1,8.15 6.1,11.11 6.6,11.62
PD4.LED_R  (via drill 0.3)
  Top 0.2: 7.23,21.92 7.4,21.75 7.4,17.88 v6.99,17.46
  Top 0.203: 7.23,21.92 5.84,23.31 5.84,24.68 RN4.7
  Bottom 0.203: U4.85 6.83,17.23 v6.99,17.46
PD5.LED_B  (via drill 0.3)
  Top 0.2: 6.03,22.48 6.8,21.71 6.8,18.73 v6.67,18.6
  Top 0.203: 6.03,22.48 5.08,23.43 5.08,24.68 RN4.6
  Bottom 0.203: U4.86 6.05,17.73 6.6,18.29 6.6,18.53 v6.67,18.6
PD6.LED_G  (via drill 0.3)
  Top 0.2: 4.32,19.43 v4.06,19.11
  Top 0.203: 4.32,19.43 4.32,24.68 RN4.5
  Bottom 0.203: U4.87 4.63,18.23 4.06,18.8 v4.06,19.11
PE0.DCMI2  (via drill 0.3)
  Top 0.2: U1.P$22 18.17,12.71 18.67,13.21 18.67,15.42 17.53,16.56 17.53,20.21 16.38,21.36 v16.38,21.46
  Bottom 0.203: v16.38,21.46 16.13,21.21 11.18,21.21 10.79,21.59 9.64,21.59 8,23.23 U4.97
PE1.DCMI3  (via drill 0.3)
  Top 0.203: v15.37,22 15.37,21.21 17.02,19.56 17.02,14.86 17.65,14.22 17.65,13.46 17.17,12.98 U1.P$20
  Bottom 0.203: v15.37,22 15.09,21.72 11.3,21.72 10.92,22.1 9.71,22.1 8.07,23.73 U4.98
PE4.DCMI4  (via drill 0.3)
  Top 0.203: v13.65,22.51 13.65,21.65 16.1,19.2 16.1,13.36 16.17,13.29 U1.P$18
  Bottom 0.203: v13.65,22.51 13.59,22.51 13.31,22.23 11.56,22.23 11.18,22.61 9.77,22.61 8.14,24.23 U4.3
PE5.DCMI6  (via drill 0.3)
  Top 0.203: v11.94,22.98 11.94,21.34 13.08,20.19 13.08,16.8 14.1,15.78 14.1,12.83 14.17,12.75 U1.P$14
  Bottom 0.203: U4.4 8.64,24.3 9.87,23.08 11.84,23.08 v11.94,22.98
PE6.DCMI7  (via drill 0.3)
  Top 0.203: v10.35,24.27 10.35,22.29 12.57,20.07 12.57,12.95 13.17,12.36 U1.P$12
  Bottom 0.203: U4.5 9.14,25.47 v10.35,24.27
PE9.XCLK  (via drill 0.3)
  Top 0.203: U1.P$13 13.67,15.03 13.59,15.11 13.34,15.11 v13.34,15.24
  Bottom 0.203: v13.34,15.24 14.57,15.24 17.06,17.73 U4.40
RAW
  Bottom 0.406: D2.2 8.45,0.95 JP1.8
VCAP1
  Bottom 0.254: U4.49 21.89,13.23 22.23,13.58 22.4,13.58
  Bottom 0.305: 22.4,13.58 C13.1
VCAP2
  Bottom 0.25: 8.14,10.11 8.61,9.64 C12.1
  Bottom 0.254: U4.73 8.14,10.11
VCC  (via drill 0.3)
  Top 0.203: 20.17,6.73 20.07,6.54 20,6.54 | 17.14,7.18 RN5.6 | 16.3,7.2 RN5.5 16.33,7.11 v16.64,6.59
  Top 0.254: 20,6.54 20.07,6.48 17.34,6.48 17.14,6.67 17.14,7.18 | RN5.5 RN5.6 | v11.62,7.94 11.24,8.32 7.3,8.32 6.86,8.76 v6.86,9.78
  Top 0.3: RN1.1 RN1.2 RN1.3 17.29,22.59 v17.02,22.86
  Top 0.305: C15.1 20.17,6.73 20.17,8.04 U7.8
  Top 0.4: 6.1,28.32 v6.35,28.32 | 17.87,29.59 v17.14,29.59
  Top 0.406: 21.04,26.92 U2.P$4 22.7,26.95 v22.48,26.92 | LED2.3 LED2.2 LED2.1 5.93,28.49 6.1,28.32 | RN2.4 17.87,29.59 RN2.3 RN2.2 | v6.35,28.32 6.73,28.7 8.57,28.7 v9.08,29.21 9.08,29.15 9.14,29.08 13.72,29.08 v14.61,28.19 16.64,28.19 17.14,28.7 v17.14,29.59 | 22.23,8 23.8,6.43 23.8,2.24 v23.57,2 | 22.23,8 22.18,8.04 U7.8 | 22.23,8 22.23,10.03 23.4,11.21 v23.4,13.26 23.37,13.3 23.5,13.3 23,13.8 23,19 23.8,19.8 23.77,19.83 v23.8,19.86
  Bottom 0.203: RN3.3 1.8,22.24 1.52,21.97 1.52,20.83 1.78,20.57 2.44,20.57 RN3.1 | 3.8,24.73 3.81,24.74 3.81,24.77
  Bottom 0.25: U4.22 17.64,27.36 17.91,27.62 17.91,28.24 | U4.22 U4.21 | 9.34,28.24 9.34,27.5 9.64,27.19 U4.6 | U4.11 12.14,27.48 11.81,27.81 11.81,28.19 | U4.19 16.14,27.04 15.37,27.81 15.37,28.19 | 15.37,28.19 v14.61,28.19 | C1.2 15.43,28.26 15.37,28.19 | U4.28 22.5,23.73 C8.2 | U4.22 17.64,25.41 17.65,25.4
  Bottom 0.254: 3.8,24.73 C11.1 3.7,24.79 3.68,24.77 | 2.22,24.77 C24.2 | U4.50 22.36,12.73 C6.2 | U4.75 7.14,10.07 v6.86,9.78 6.8,9.64 C10.1 | v16.64,6.59 16.61,6.76 12.8,6.76 v11.62,7.94
  Bottom 0.279: U4.100 3.8,24.73
  Bottom 0.3: 9.34,28.24 9.34,29.02 9.27,29.08 | 9.27,29.08 v9.08,29.21 9.14,29.21 9.27,29.08 | C14.2 17.91,28.26 17.91,29.59 | C7.1 11.87,28.26 11.81,28.19 11.81,28.83 11.56,29.08 9.27,29.08 | 17.64,25.41 17.64,23.49 v17.02,22.86
  Bottom 0.305: 17.91,28.24 C14.2 | 9.34,28.24 C9.1 | 22.4,12.7 C6.2
  Bottom 0.4: C25.1 24.06,27.05 22.61,27.05 v22.48,26.92 22.42,26.99 C3.1 | v17.14,29.59 17.91,29.59
  Bottom 0.406: RN3.3 RN3.4 2.25,24.7 C24.2 | v23.4,13.26 23.4,12.86 23.8,12.6 C4.2 24.25,12.7 22.4,12.7 | U3.5 23.66,2.1 v23.57,2 23.7,2.1 24.68,2.1 24.68,0.76 C20.1 | 17.91,29.59 20.45,29.59 21.21,28.83 21.21,27.3 21.59,26.92 v22.48,26.92 | 23.77,23.75 23.8,26.98 C25.1 | 3.68,24.77 2.22,24.77 | v6.35,28.32 6.32,28.32 5.75,27.75 5.75,26.2 4.32,24.77 3.81,24.77 | 23.77,23.75 22.54,23.75 C8.2 | 23.77,23.75 23.77,19.9 v23.8,19.86
VIN  (via drill 0.3)
  Top 0.406: 6.41,1.08 6.86,0.51 10.49,0.51 v10.54,0.66 | D3.1 6.41,1.08 | 6.41,1.08 6.44,1.08 v6.38,1.02
  Bottom 0.406: U3.1 20.83,2.1 | U8.3 21.02,9.46 20.83,9.27 20.83,7.62 | 20.83,7.62 20.83,4 | 20.83,4 20.83,2.1 | U8.1 20.89,7.56 20.83,7.62 | U3.3 20.83,4 | 20.83,2.1 20.83,1.27 20.18,0.62 19.68,0.62 | D1.1 D2.1 5.39,1.02 v6.38,1.02 | v10.54,0.66 10.6,0.51 19.68,0.51 19.68,0.62 | 19.68,0.62 C16.1

### Text on the board
tPlace: RESET | SEL | SCK | SDI | SDO | VCC | GND | TXD | RXD
bPlace: Debug
Reference: NRST | SWDIO | BOOT0 | GND | VEXT0 | SWCLK | SPI3_SSEL | SPI3_SCLK | SPI3_MISO | SPI3_MOSI | VEXT1 | I2C2_SCL | I2C2_SDA | GND